# EasyEDA schematic Schematics_2.json

## Sheets
1 Sheet_1: TITLE: EXTENc; REV: 1.0; Date: 2020-08-23; Sheet: 1/1; Drawn By: Fangbrbr; Company: Your Company
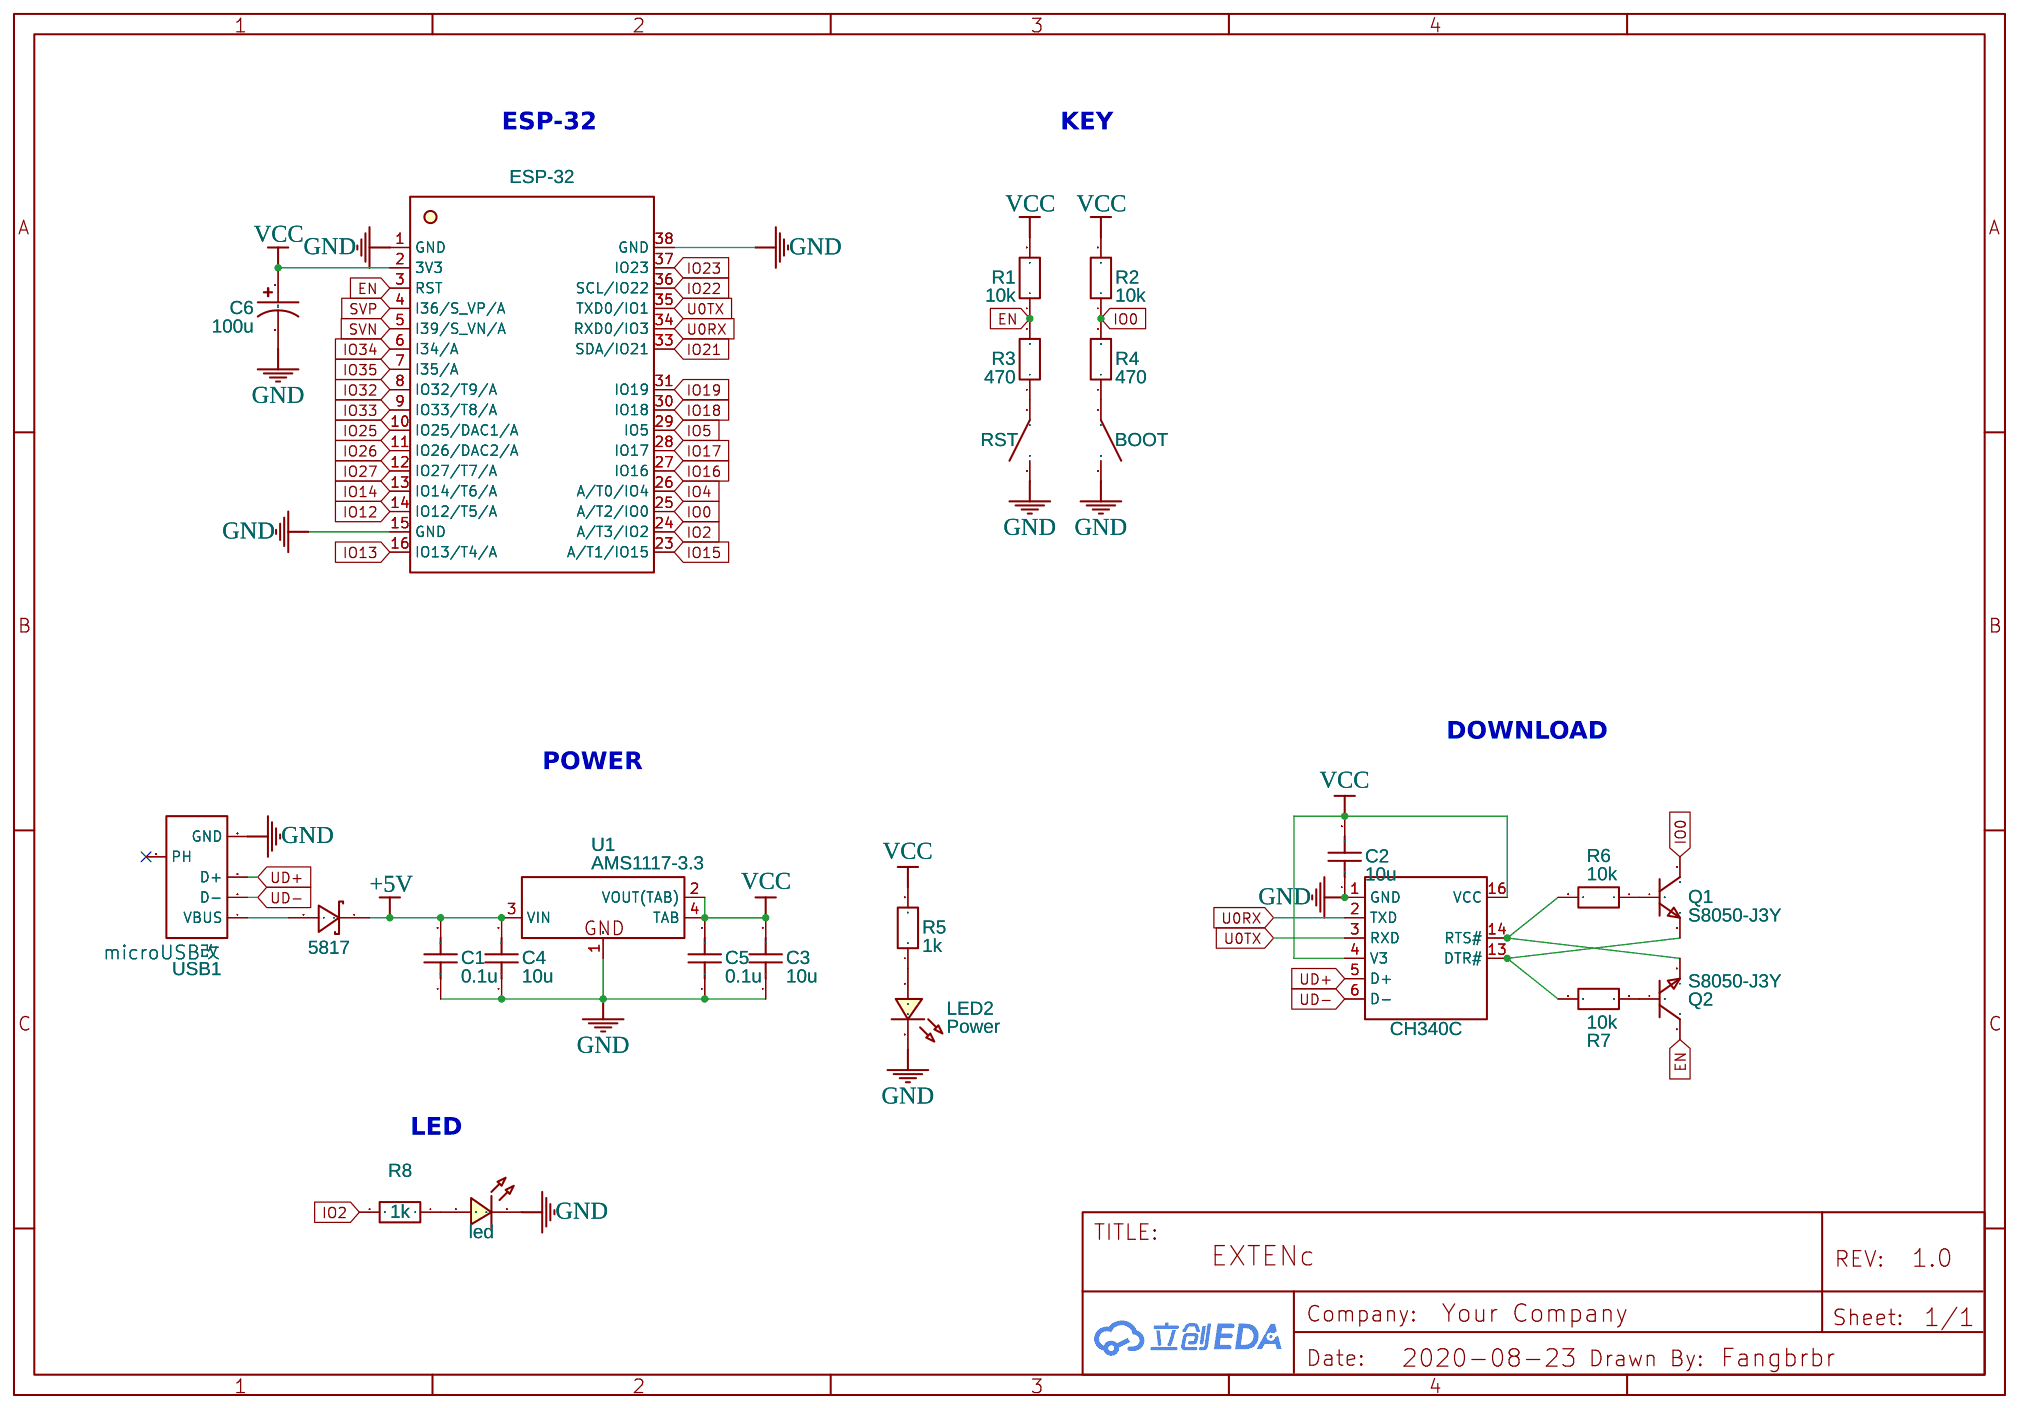
[diagram p0: Sheet_1]
2 Sheet_2: TITLE: CONTROLLER; Date: 2024-01-31; Drawn By: AN T.NGUYEN; Company: TON DUC THANG UNIVERSITY
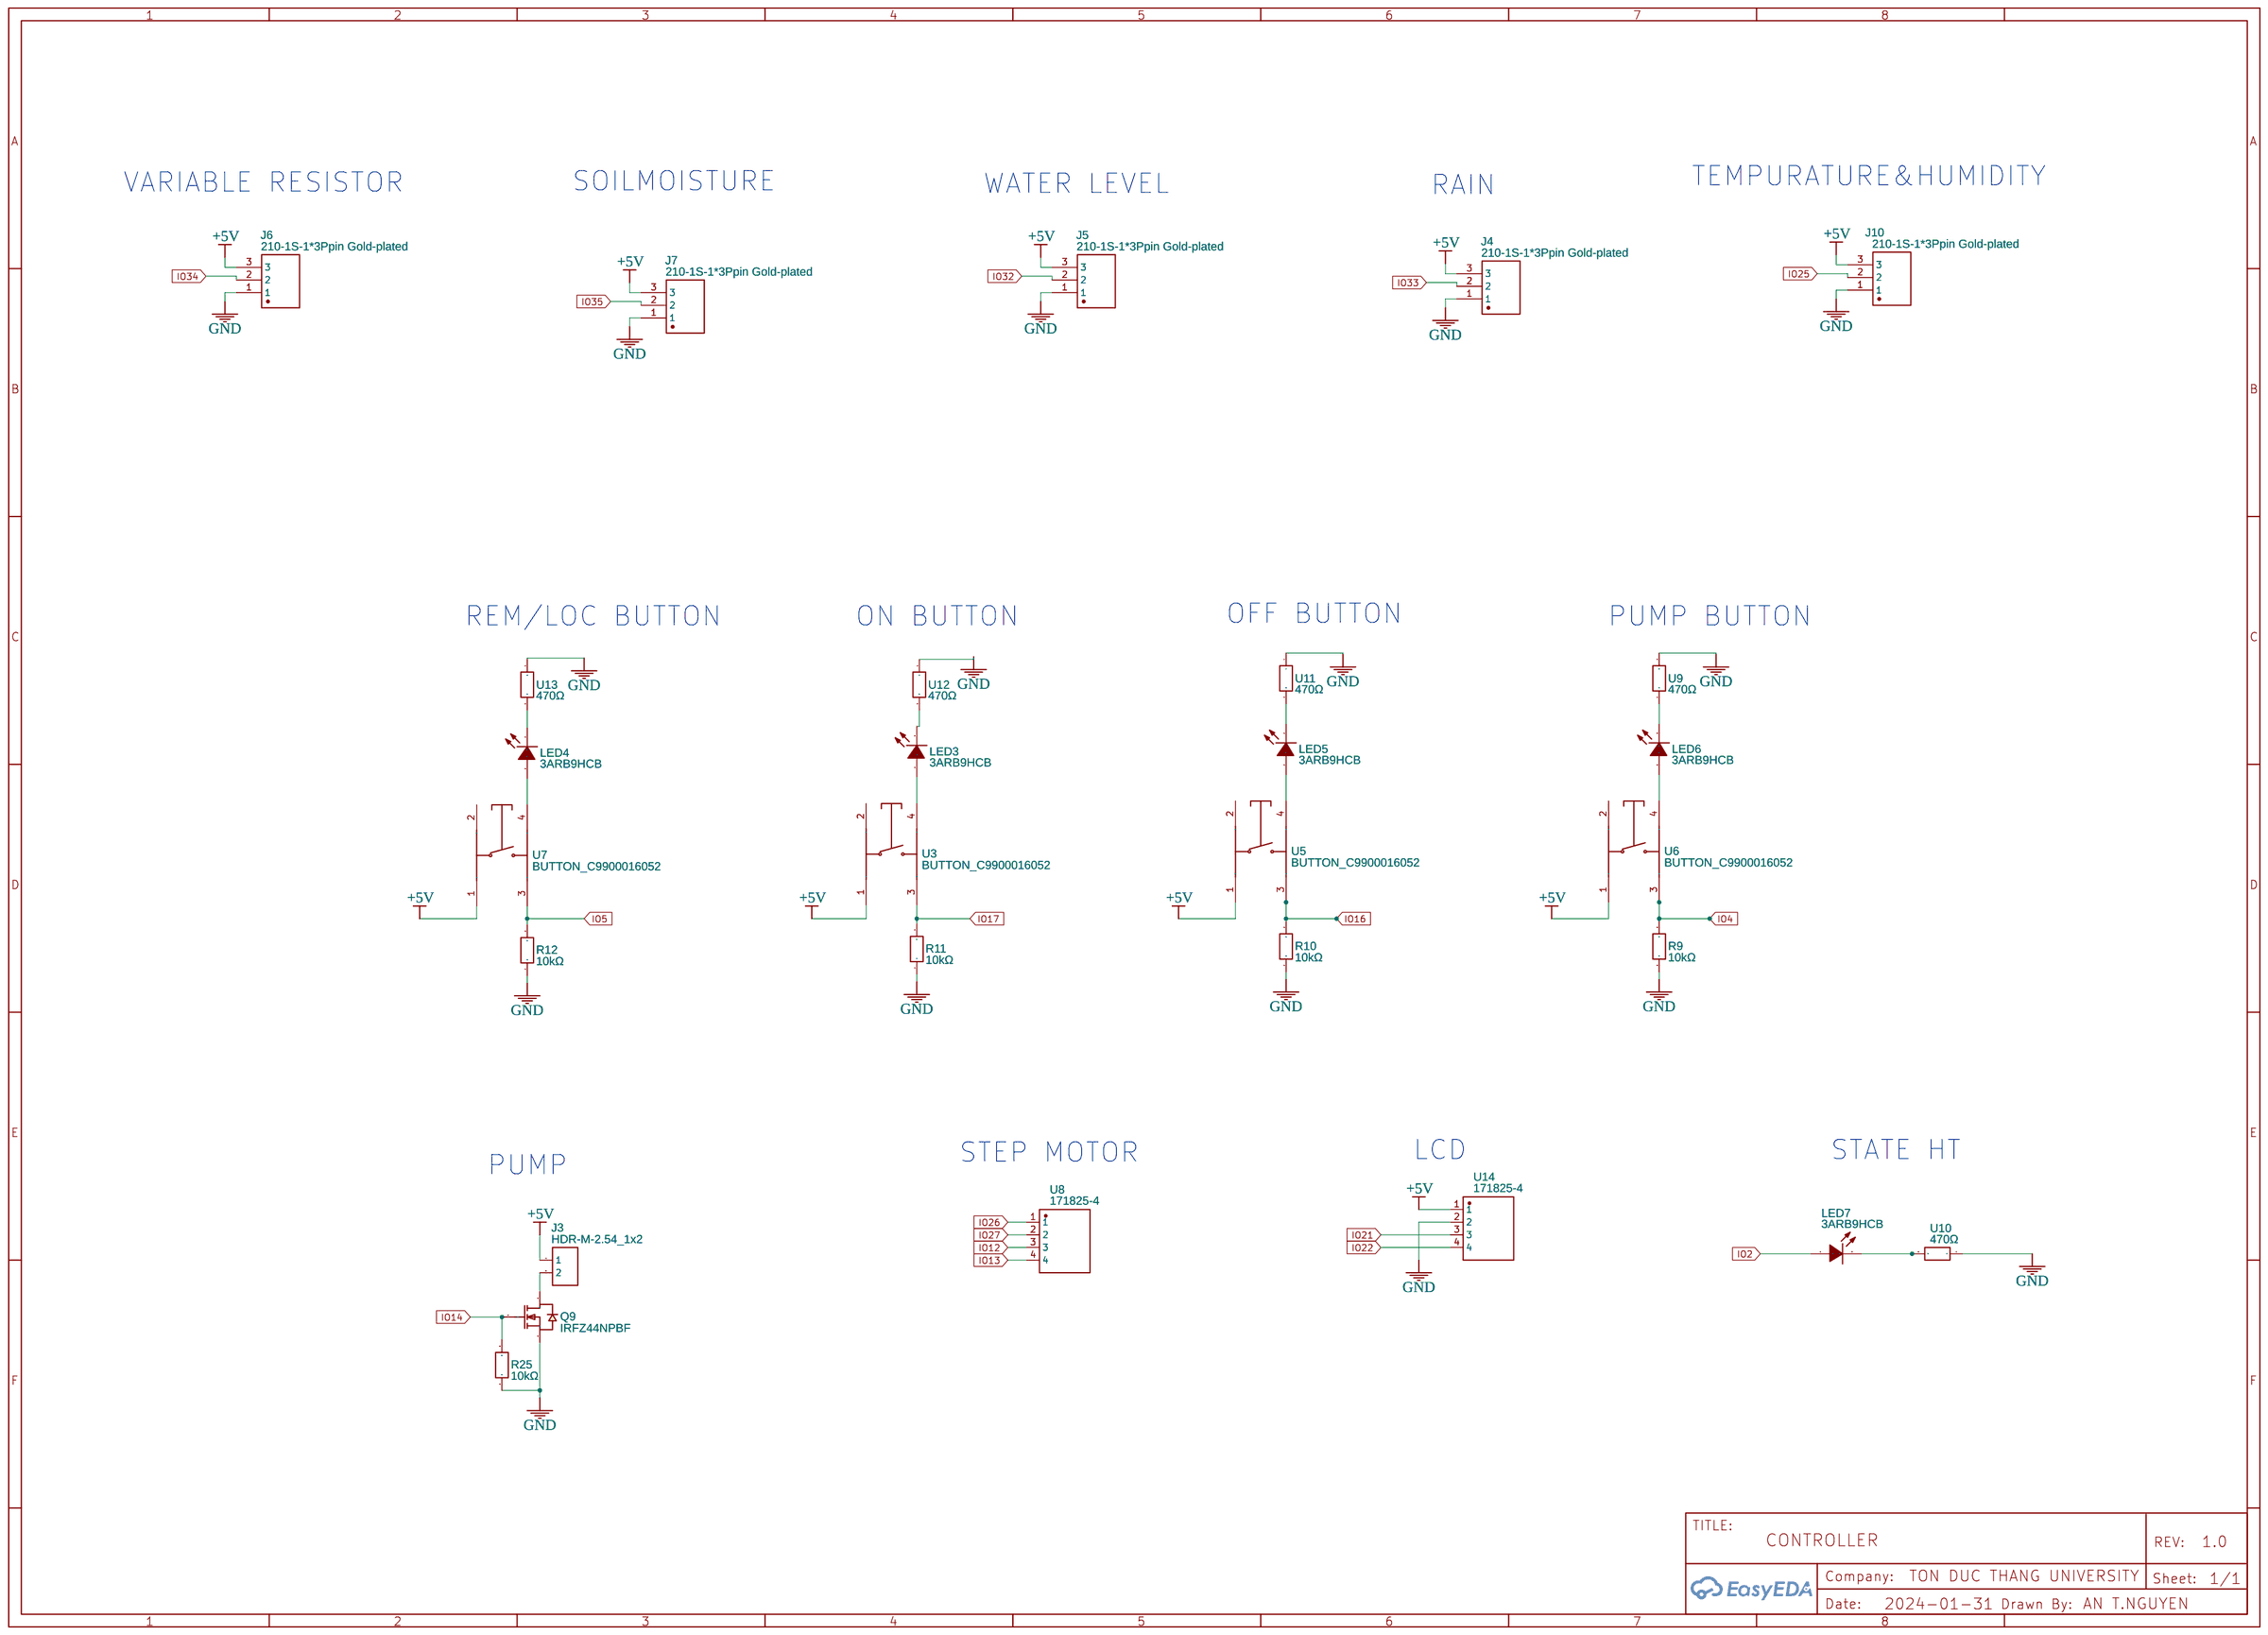
[diagram p1: Sheet_2]

## Parts
sheet Sheet_1
C1  0.1u  [C0603]
C2  10u  [C0603]
C3  10u  [C0603]
C4  10u  [C0603]
C5  0.1u  [C0603]
C6  100u  [CASE-B_3528]
D1  5817  [SOD-123F_L2.8-W1.8-LS3.7-RD]
LED1  led  [LED0603_RED]
LED2  Power  [LED0603_RED]
Q1  S8050-J3Y  [SOT-23-3_L3.0-W1.7-P0.95-LS2.9-BR]
Q2  S8050-J3Y  [SOT-23-3_L3.0-W1.7-P0.95-LS2.9-BR]
R1  10k  [R0603]
R2  10k  [R0603]
R3  470  [R0603]
R4  470  [R0603]
R5  1k  [R0603]
R6  10k  [R0603]
R7  10k  [R0603]
R8  1k  [R0603]
SW1  RST  [SW-SMD_L4.0-W2.9-LS5.0-A]
SW2  BOOT  [SW-SMD_L4.0-W2.9-LS5.0-A]
U1  AMS1117-3.3  [SOT-223_L6.7-W3.5-P2.30-BR]
U2  CH340C  [CH340C]
U4  ESP-32  [ESP-32]
USB1  microUSB改  [USB-MODIFIED]
sheet Sheet_2
J3  HDR-M-2.54_1x2  [HDR-M-2.54_1X2]
J4  210-1S-1*3Ppin Gold-plated  [HDR-TH_3P-P1.27-V-M-1]
J5  210-1S-1*3Ppin Gold-plated  [HDR-TH_3P-P1.27-V-M-1]
J6  210-1S-1*3Ppin Gold-plated  [HDR-TH_3P-P1.27-V-M-1]
J7  210-1S-1*3Ppin Gold-plated  [HDR-TH_3P-P1.27-V-M-1]
J10  210-1S-1*3Ppin Gold-plated  [HDR-TH_3P-P1.27-V-M-1]
LED3  3ARB9HCB  [LED-3MM]
LED4  3ARB9HCB  [LED-3MM]
LED5  3ARB9HCB  [LED-3MM]
LED6  3ARB9HCB  [LED-3MM]
LED7  3ARB9HCB  [LED-3MM]
Q9  IRFZ44NPBF  [TO-220-3_L10.0-W4.5-P2.54-L]
R9  10kΩ  [RES-TH_BD1.6-L3.6-P7.60-D0.5]
R10  10kΩ  [RES-TH_BD1.6-L3.6-P7.60-D0.5]
R11  10kΩ  [RES-TH_BD1.6-L3.6-P7.60-D0.5]
R12  10kΩ  [RES-TH_BD1.6-L3.6-P7.60-D0.5]
R25  10kΩ  [RES-TH_BD1.6-L3.6-P7.60-D0.5]
U3  BUTTON_C9900016052  [SW-SMD_4P-L5.1-W5.1-P3.70-LS6.5-TL-2]
U5  BUTTON_C9900016052  [SW-SMD_4P-L5.1-W5.1-P3.70-LS6.5-TL-2]
U6  BUTTON_C9900016052  [SW-SMD_4P-L5.1-W5.1-P3.70-LS6.5-TL-2]
U7  BUTTON_C9900016052  [SW-SMD_4P-L5.1-W5.1-P3.70-LS6.5-TL-2]
U8  171825-4  [HDR-TH_4P-P2.54-D1.0]
U9  470Ω  [RES-TH_BD2.3-L6.5-P10.50-D0.5]
U10  470Ω  [RES-TH_BD2.3-L6.5-P10.50-D0.5]
U11  470Ω  [RES-TH_BD2.3-L6.5-P10.50-D0.5]
U12  470Ω  [RES-TH_BD2.3-L6.5-P10.50-D0.5]
U13  470Ω  [RES-TH_BD2.3-L6.5-P10.50-D0.5]
U14  171825-4  [HDR-TH_4P-P2.54-D1.0]

## Library data of the parts
C1-C5 = C_0603_US: Contributor: LCEDA_Lib
C6 = C_Tan_SMD_B_US: Contributor: LCEDA_Lib
D1 = 1N5819W: Supplier: LCSC; Supplier Part: C169540; Manufacturer: Shandong Jingdao Microelectronics; Contributor: LCSC; LCSC Assembly: Yes; SMT Type: Extend
LED1 LED2 = LED-0603_R: Manufacturer: EVERLIGHT(台湾亿光); Manufacturer Part: 19-217/R6C-AL1M2VY/3T; Supplier Part: C72044; Supplier: LCSC; Contributor: LCEDA_01
Q1 Q2 = S8050-J3Y: Supplier: LCSC; Supplier Part: C364312; Manufacturer: (MDD) Jiangsu Yutai Elec; Contributor: LCSC; JLCPCB Part Class: Extended Part
R1-R8 = R_0603_EU: Contributor: LCEDA_Lib
SW1 SW2 = 龟仔按键-带柱: Supplier: LCSC; Supplier Part: C354947; Manufacturer: BRIGHT; Manufacturer Part: TSA343G00D-250J2; Contributor: Fangbrbr
U1 = AMS1117-3.3: Supplier: LCSC; Supplier Part: C347222; Manufacturer: Youtai Semiconductor Co., Ltd.; Contributor: Fangbrbr; SMT Type: Extend; JLCPCB SMD: Yes
U2 = CH340C: Supplier: LCSC; Manufacturer: WCH; Supplier Part: C84681; Paste Type: recommend; Contributor: Fangbrbr
U4 = 安信可ESP-32S: Supplier: LCSC; Supplier Part: C82899; Manufacturer: Ai-Thinker; Manufacturer Part: ESP-32S; Contributor: Fangbrbr
USB1 = microUSB改: Supplier: LCSC; Supplier Part: C393940; Manufacturer: SHOU HAN; Manufacturer Part: MICRO5.9mmusb; Contributor: Fangbrbr
J3 = HDR-M-2.54_1x2: Supplier Part: C124375; Supplier: LCSC; Contributor: LCEDA_Lib
J4-J7 J10 = 210-1S-1*3Ppin Gold-plated: Supplier: LCSC; Manufacturer: Ckmtw; Contributor: LCSC; Supplier Part: C124354; JLCPCB Part Class: Extended Part
LED3-LED7 = 3ARB9HCB: Supplier: LCSC; Manufacturer: KENTO; Supplier Part: C42016
Q9 = IRFZ44NPBF: Supplier: LCSC; Manufacturer: Infineon(英飞凌); Supplier Part: C2586; JLCPCB Part Class: Extended Part
R9-R12 R25 = CMF5010K000FHEB: Contributor: lcsc; Supplier: LCSC; Supplier Part: C3008835; Manufacturer: VISHAY(威世); JLCPCB Part Class: Extended Part
U3 U5-U7 = BUTTON_C9900016052: Contributor: lcsc; Supplier: LCSC; Supplier Part: C9900016052; Manufacturer: null; Manufacturer Part: button; JLCPCB Part Class: Extended Part
U8 U14 = 171825-4: Contributor: LCSC; Supplier: LCSC; Supplier Part: C210162; Manufacturer: TE Connectivity(泰科电子); JLCPCB Part Class: Extended Part
U9-U13 = CF1/4W-470Ω±5%T52: Contributor: lcsc; Supplier: LCSC; Supplier Part: C714293; Manufacturer: 华星机电; JLCPCB Part Class: Extended Part

## Nets
+5V: C1.2 C4.2 D1.1 J3.1 J4.3 J5.3 J6.3 J7.3 J10.3 U1.3(VIN) U3.1 U5.1 U6.1 U7.1 U14.1
GND: C1.1 C2.1 C3.1 C4.1 C5.1 C6.2 J4.1 J5.1 J6.1 J7.1 J10.1 LED1.2 LED2.2 Q9.3(S) R9.1 R10.1 R11.1 R12.1 R25.1 SW1.2 SW2.2 U1.1(ADJ(GND)) U2.1(GND) U4.1(GND) U4.15(GND) U4.38(GND) U9.2 U10.1 U11.1 U12.1 U13.1 U14.2 USB1.5(GND)
VCC: C2.2 C3.2 C5.2 C6.1 R1.2 R2.2 R5.2 U1.2(VOUT(TAB)) U1.4(TAB) U2.4(V3) U2.16(VCC) U4.2(3V3)
EN: Q2.3(C) R1.1 R3.2 U4.3(RST)
IO0: Q1.3(C) R2.1 R4.2 U4.25(A/T2/IO0)
IO2: LED7.1(A) R8.2 U4.24(A/T3/IO2)
IO4: R9.2 U4.26(A/T0/IO4) U6.3
IO5: R12.2 U4.29(IO5) U7.3
IO12: U4.14(IO12/T5/A) U8.3
IO13: U4.16(IO13/T4/A) U8.4
IO14: Q9.1(G) R25.2 U4.13(IO14/T6/A)
IO15: U4.23(A/T1/IO15)
IO16: R10.2 U4.27(IO16) U5.3
IO17: R11.2 U3.3 U4.28(IO17)
IO18: U4.30(IO18)
IO19: U4.31(IO19)
IO21: U4.33(SDA/IO21) U14.3
IO22: U4.36(SCL/IO22) U14.4
IO23: U4.37(IO23)
IO25: J10.2 U4.10(IO25/DAC1/A)
IO26: U4.11(IO26/DAC2/A) U8.1
IO27: U4.12(IO27/T7/A) U8.2
IO32: J5.2 U4.8(IO32/T9/A)
IO33: J4.2 U4.9(IO33/T8/A)
IO34: J6.2 U4.6(I34/A)
IO35: J7.2 U4.7(I35/A)
SVN: U4.5(I39/S_VN/A)
SVP: U4.4(I36/S_VP/A)
U0RX: U2.2(TXD) U4.34(RXD0/IO3)
U0TX: U2.3(RXD) U4.35(TXD0/IO1)
UD+: U2.5(D+) USB1.3(D+)
UD-: U2.6(D-) USB1.2(D-)
Net-(D1-2): D1.2 USB1.1(VBUS)
Net-(J3-2): J3.2 Q9.2(D)
Net-(LED1-1): LED1.1 R8.1
Net-(LED2-1): LED2.1 R5.1
Net-(LED3-1): LED3.1(A) U3.4
Net-(LED3-2): LED3.2(K) U12.2
Net-(LED4-1): LED4.1(A) U7.4
Net-(LED4-2): LED4.2(K) U13.2
Net-(LED5-1): LED5.1(A) U5.4
Net-(LED5-2): LED5.2(K) U11.2
Net-(LED6-1): LED6.1(A) U6.4
Net-(LED6-2): LED6.2(K) U9.1
Net-(LED7-2): LED7.2(K) U10.2
Net-(Q1-1): Q1.1(B) R6.1
Net-(Q1-2): Q1.2(E) R7.2 U2.13(DTR#)
Net-(Q2-1): Q2.1(B) R7.1
Net-(Q2-2): Q2.2(E) R6.2 U2.14(RTS#)
Net-(R3-1): R3.1 SW1.1
Net-(R4-1): R4.1 SW2.1

Not connected (* = marked no-connect by the designer): U3 2; U5 2; U6 2; U7 2; USB1 0(PH)*

## Notes on the sheets
sheet 1
- ESP-32
- KEY
- DOWNLOAD
- POWER
- LED
sheet 2
- VARIABLE RESISTOR
- SOILMOISTURE
- WATER LEVEL
- RAIN
- TEMPURATURE&HUMIDITY
- REM/LOC BUTTON
- ON BUTTON
- OFF BUTTON
- PUMP BUTTON
- STEP MOTOR
- LCD
- STATE HT
- PUMP
